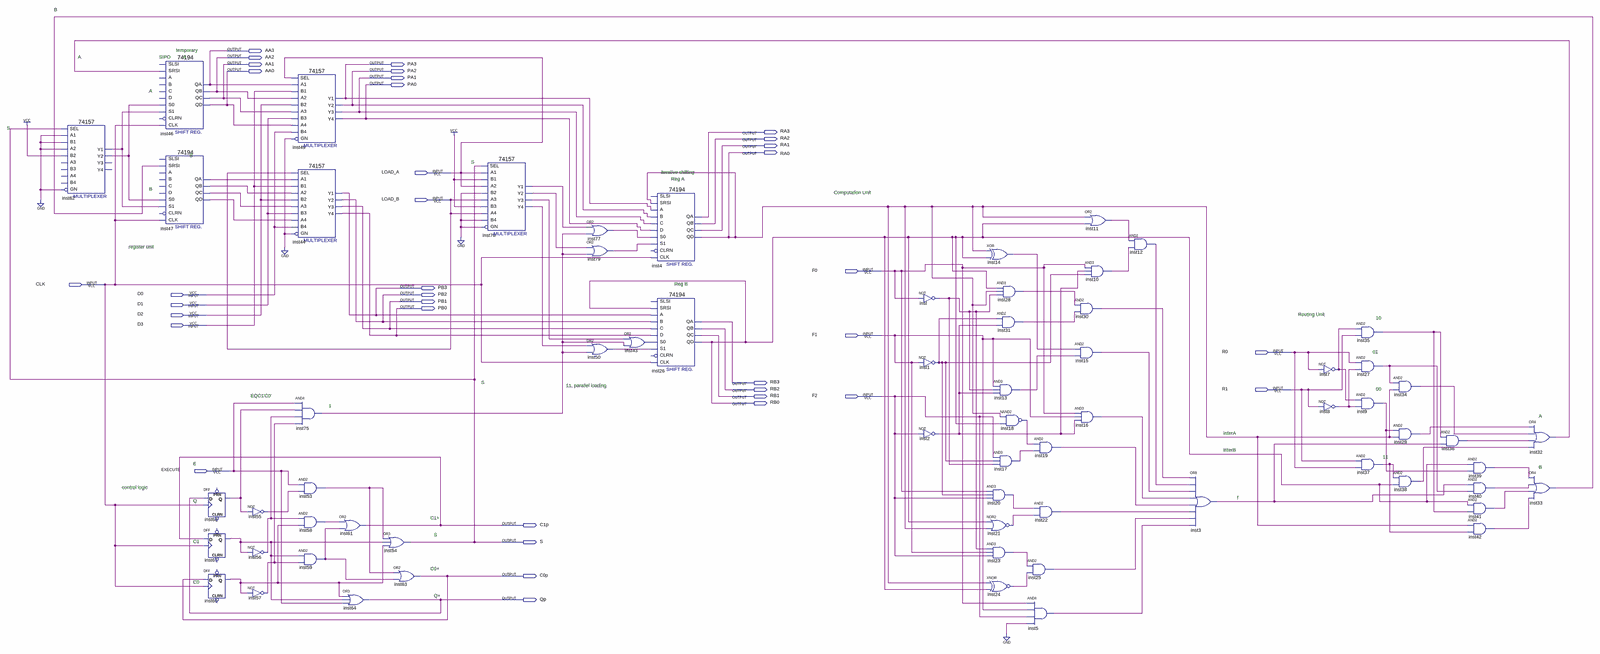
[diagram p0: schematic sheet, whole]
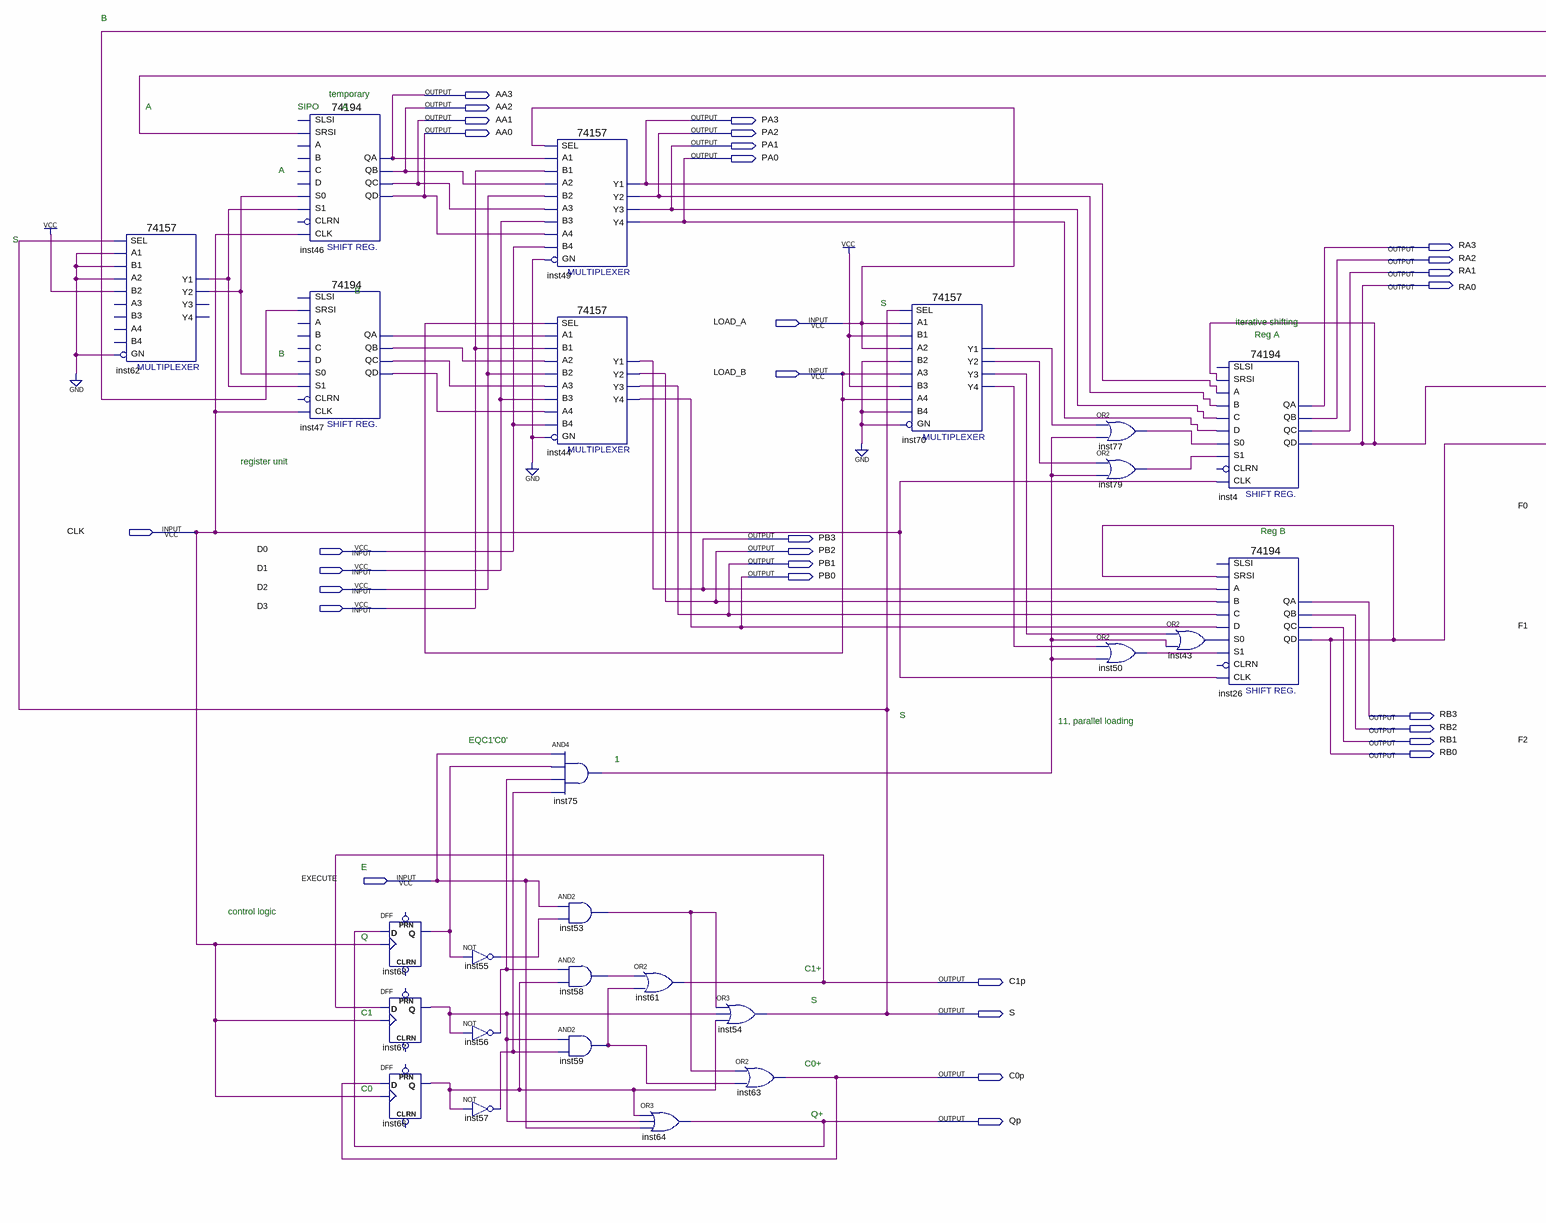
[diagram p1: schematic sheet, left part]
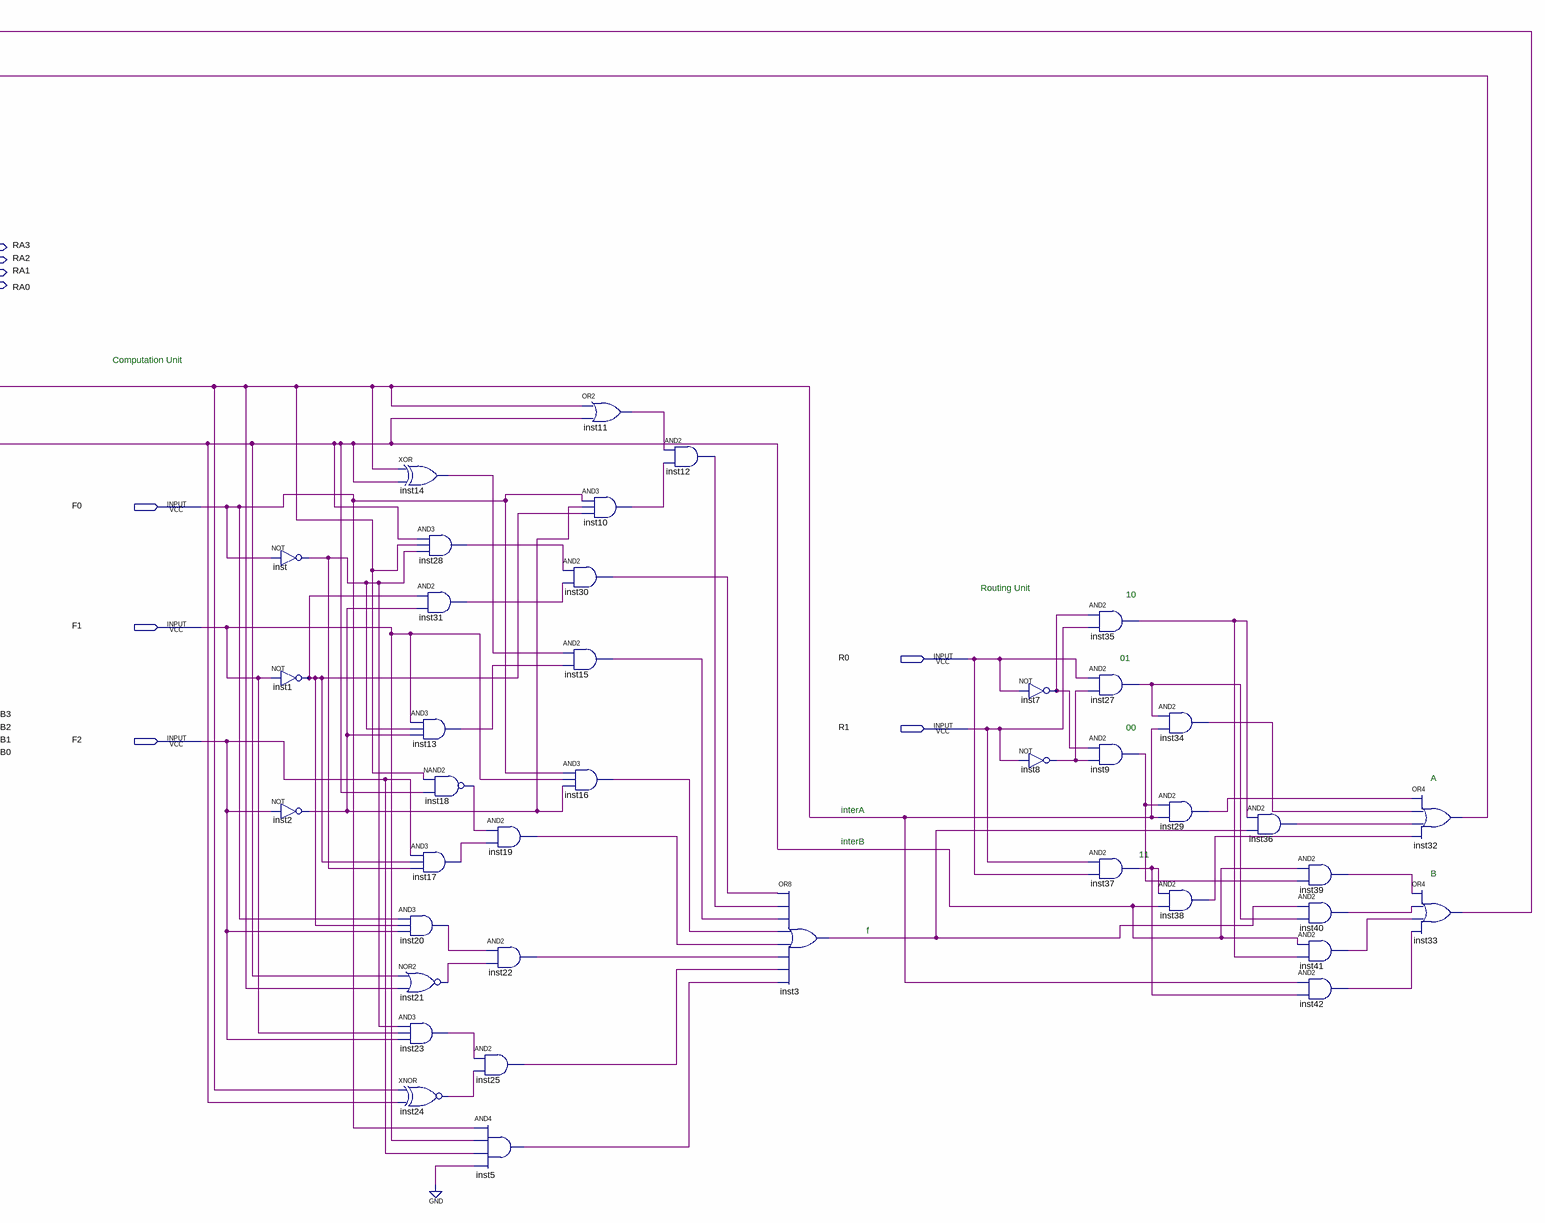
[diagram p2: schematic sheet, right part]
// Quartus schematic Lab3.bdf as structural Verilog: 66 symbols, 37 pins
module Lab3 (
  input  LOAD_A,
  input  LOAD_B,
  input  F0,
  input  CLK,
  input  D0,
  input  D1,
  input  D2,
  input  D3,
  input  F1,
  input  R0,
  input  R1,
  input  F2,
  input  EXECUTE,
  output AA3,
  output AA2,
  output AA1,
  output PA3,
  output AA0,
  output PA2,
  output PA1,
  output PA0,
  output RA3,
  output RA2,
  output RA1,
  output RA0,
  output PB3,
  output PB2,
  output PB1,
  output PB0,
  output RB3,
  output RB2,
  output RB1,
  output RB0,
  output C1p,
  output S,
  output C0p,
  output Qp
);

  wire inst1_out, inst2_out, inst3_out, inst5_out, inst7_out, inst8_out, inst9_out, inst10_out, inst11_out,
       inst12_out, inst13_out, inst14_out, inst15_out, inst16_out, inst17_out, inst18_out, inst19_out,
       inst20_out, inst21_out, inst22_out, inst23_out, inst24_out, inst25_out, inst27_out, inst28_out,
       inst29_out, inst30_out, inst31_out, inst32_out, inst33_out, inst34_out, inst35_out, inst36_out,
       inst37_out, inst38_out, inst39_out, inst40_out, inst41_out, inst42_out, inst43_out, inst47_qa,
       inst47_qb, inst47_qc, inst47_qd, inst50_out, inst53_out, inst55_out, inst56_out, inst57_out,
       inst58_out, inst59_out, inst62_y1, inst62_y2, inst66_q, inst67_q, inst68_q, inst70_y1, inst70_y2,
       inst70_y3, inst70_y4, inst75_out, inst77_out, inst79_out, inst_out;

  \74157  inst62 (
    .A1(1'b0), .B1(1'b0), .SEL(S), .B2(1'b1), .A2(1'b0), .GN(1'b0), .Y2(inst62_y2), .Y1(inst62_y1));  // open: A3, B3, B4, A4, Y4, Y3
  \74194  inst46 (
    .SRSI(inst32_out), .CLK(CLK), .S1(inst62_y1), .S0(inst62_y2), .QA(AA3), .QB(AA2), .QC(AA1), .QD(AA0));  // open: SLSI, B, C, CLRN, D, A
  \74194  inst47 (
    .SRSI(inst33_out), .CLK(CLK), .S1(inst62_y1), .S0(inst62_y2), .QA(inst47_qa), .QB(inst47_qb),
    .QC(inst47_qc), .QD(inst47_qd));  // open: SLSI, B, C, CLRN, D, A
  DFF inst68 (.CLK(CLK), .D(Qp), .Q(inst68_q));  // open: CLRN, PRN
  DFF inst67 (.CLK(CLK), .D(C1p), .Q(inst67_q));  // open: CLRN, PRN
  DFF inst66 (.CLK(CLK), .D(C0p), .Q(inst66_q));  // open: CLRN, PRN
  not inst55 (inst55_out, inst68_q);
  not inst56 (inst56_out, inst67_q);
  not inst57 (inst57_out, inst66_q);
  \74157  inst49 (
    .A1(AA3), .B1(D3), .SEL(LOAD_A), .B2(D2), .A3(AA1), .B3(D1), .A2(AA2), .B4(D0), .GN(1'b0), .A4(AA0),
    .Y2(PA2), .Y1(PA3), .Y4(PA0), .Y3(PA1));
  \74157  inst44 (
    .A1(inst47_qa), .B1(D3), .SEL(LOAD_B), .B2(D2), .A3(inst47_qc), .B3(D1), .A2(inst47_qb), .B4(D0),
    .GN(1'b0), .A4(inst47_qd), .Y2(PB2), .Y1(PB3), .Y4(PB0), .Y3(PB1));
  and inst75 (inst75_out, EXECUTE, inst68_q, inst56_out, inst57_out);
  and inst53 (inst53_out, EXECUTE, inst55_out);
  and inst58 (inst58_out, inst56_out, inst66_q);
  and inst59 (inst59_out, inst67_q, inst57_out);
  or inst61 (C1p, inst58_out, inst59_out);
  or inst64 (Qp, inst66_q, inst67_q, EXECUTE);
  or inst54 (S, inst53_out, inst67_q, inst66_q);
  or inst63 (C0p, inst53_out, inst59_out);
  \74157  inst70 (
    .A1(LOAD_A), .B1(1'b1), .SEL(S), .B2(1'b0), .A3(LOAD_B), .B3(1'b1), .A2(LOAD_A), .B4(1'b0), .GN(1'b0),
    .A4(LOAD_B), .Y2(inst70_y2), .Y1(inst70_y1), .Y4(inst70_y4), .Y3(inst70_y3));
  or inst77 (inst77_out, inst70_y1, inst75_out);
  or inst79 (inst79_out, inst70_y2, inst75_out);
  or inst50 (inst50_out, inst70_y4, inst75_out);
  or inst43 (inst43_out, inst70_y3, inst75_out);
  \74194  inst4 (
    .SRSI(RA0), .B(PA2), .C(PA1), .CLK(CLK), .D(PA0), .S1(inst79_out), .S0(inst77_out), .A(PA3), .QA(RA3),
    .QB(RA2), .QC(RA1), .QD(RA0));  // open: SLSI, CLRN
  \74194  inst26 (
    .SRSI(RB0), .B(PB2), .C(PB1), .CLK(CLK), .D(PB0), .S1(inst50_out), .S0(inst43_out), .A(PB3), .QA(RB3),
    .QB(RB2), .QC(RB1), .QD(RB0));  // open: SLSI, CLRN
  not inst (inst_out, F0);
  not inst1 (inst1_out, F1);
  not inst2 (inst2_out, F2);
  xor inst14 (inst14_out, RA0, RB0);
  and inst28 (inst28_out, RB0, RA0, inst_out);
  and inst31 (inst31_out, inst1_out, inst2_out);
  and inst13 (inst13_out, F1, inst_out, inst2_out);
  nand inst18 (inst18_out, RA0, RB0);
  and inst17 (inst17_out, F2, inst1_out, inst_out);
  and inst20 (inst20_out, F0, inst1_out, F2);
  nor inst21 (inst21_out, RB0, RA0);
  and inst23 (inst23_out, inst_out, F1, F2);
  xnor inst24 (inst24_out, RA0, RB0);
  and inst25 (inst25_out, inst23_out, inst24_out);
  and inst5 (inst5_out, F0, F1, F2, 1'b0);
  and inst19 (inst19_out, inst18_out, inst17_out);
  and inst22 (inst22_out, inst20_out, inst21_out);
  or inst11 (inst11_out, RA0, RB0);
  and inst10 (inst10_out, F0, inst2_out, inst1_out);
  and inst30 (inst30_out, inst28_out, inst31_out);
  and inst15 (inst15_out, inst14_out, inst13_out);
  and inst16 (inst16_out, F0, F1, inst2_out);
  and inst12 (inst12_out, inst11_out, inst10_out);
  or inst3 (inst3_out, inst30_out, inst12_out, inst15_out, inst16_out, inst19_out, inst22_out, inst25_out, inst5_out);
  not inst7 (inst7_out, R0);
  not inst8 (inst8_out, R1);
  and inst35 (inst35_out, inst7_out, R1);
  and inst27 (inst27_out, R0, inst8_out);
  and inst9 (inst9_out, inst7_out, inst8_out);
  and inst37 (inst37_out, R1, R0);
  and inst34 (inst34_out, inst27_out, RA0);
  and inst29 (inst29_out, inst9_out, RA0);
  and inst38 (inst38_out, inst37_out, RB0);
  and inst36 (inst36_out, inst35_out, inst3_out);
  and inst39 (inst39_out, RB0, inst9_out);
  and inst40 (inst40_out, inst3_out, inst27_out);
  and inst41 (inst41_out, RB0, inst35_out);
  and inst42 (inst42_out, RA0, inst37_out);
  or inst32 (inst32_out, inst29_out, inst34_out, inst36_out, inst38_out);
  or inst33 (inst33_out, inst39_out, inst40_out, inst41_out, inst42_out);

  // Notes on the sheet:
  //   B
  //   temporary
  //   A
  //   SIPO
  //   A
  //   A
  //   S
  //   B
  //   S
  //   iterative shifting
  //   Reg A
  //   B
  //   Computation Unit
  //   register unit
  //   Reg B
  //   Routing Unit
  //   10
  //   01
  //   S
  //   11, parallel loading
  //   00
  //   EQC1'C0'
  //   1
  //   A
  //   interA
  //   interB
  //   11
  //   E
  //   B
  //   control logic
  //   f
  //   Q
  //   C1+
  //   S
  //   C1
  //   C0+
  //   C0
  //   Q+
endmodule
